# EasyEDA schematic SCH_smartFemX.json
TITLE: SmartFemX; REV: 1.0; Date: 2025-10-04; Sheet: 1/1; Drawn By: sumitmaheshwari; Company: HackAura
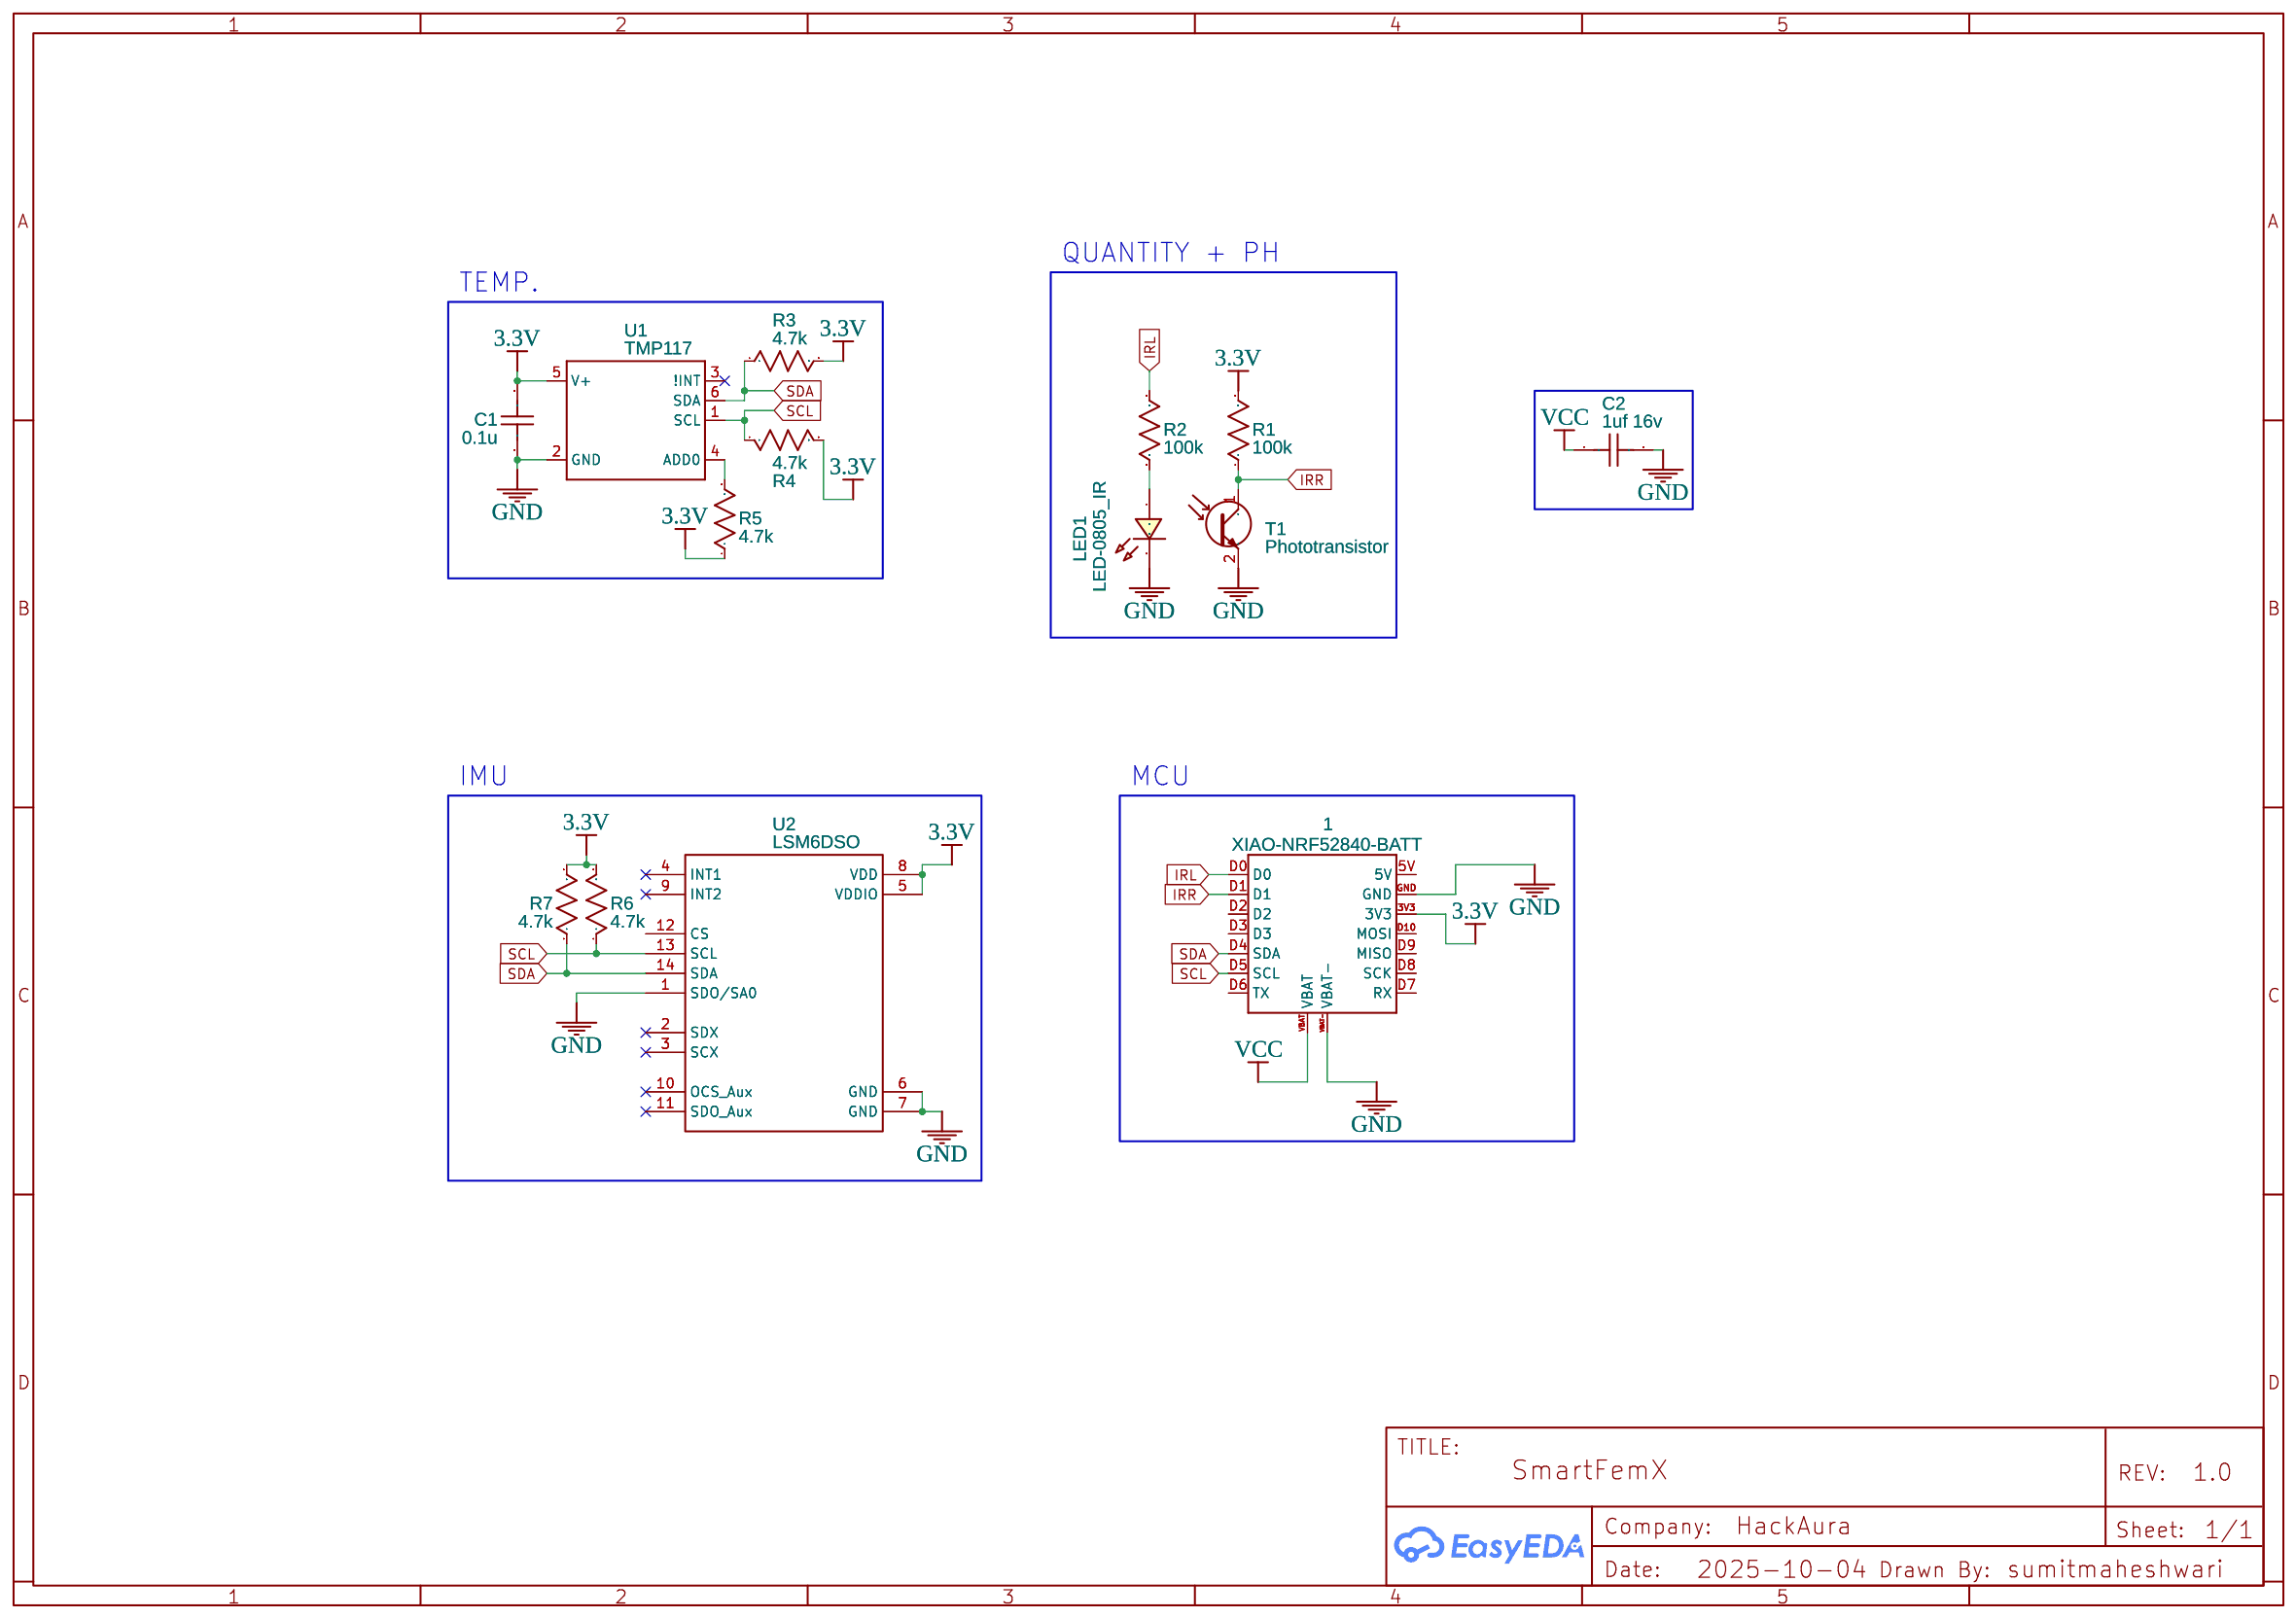
[diagram p0: schematic sheet]

## Parts
1  XIAO-NRF52840-BATT  [XIAO-NRF52840-BATT]
C1  0.1u  [C0402_NEW]
C2  1uf 16v  [SMD-2_L1.0-W0.5_D1LPC0402]
LED1  LED-0805_IR  [LED0805_RED]
R1  100k  [R0402]
R2  100k  [R0402]
R3  4.7k  [R0402]
R4  4.7k  [R0402]
R5  4.7k  [R0402]
R6  4.7k  [R0402]
R7  4.7k  [R0402]
T1  Phototransistor  [PHOTOTRANSISTOR_SMD]
U1  TMP117  [TMP117]
U2  LSM6DSO  [LGA-14L]

## Library data of the parts
1 = XIAO-NRF52840-BATT: Contributor: vimalbhalodia
C1 C2 = C_0805_US: Contributor: LCEDA_Lib
LED1 = LED-0805_R: Manufacturer: EVERLIGHT(台湾亿光); Manufacturer Part: 17-21SURC/S530-A3/TR8; Supplier Part: C72037; Contributor: LCEDA_Lib
R1-R7 = R_0805_US: Contributor: LCEDA_Lib
T1 = Phototransistor_VEMT3700-GS08_SMD: Contributor: babserg; Manufacturer Part: VEMT3700-GS08; Supplier Part: C143719; Supplier: LCSC; Manufacturer: Vishay
U1 = TMP117: Contributor: Rahul Singh
U2 = LSM6DSO: Manufacturer: ST; Supplier: Digi-Key; Supplier Part: 497-18367-6-ND; Contributor: erhans

## Nets
3.3V: 1.3V3 C1.2 R1.2 R3.2 R4.2 R5.1 R6.2 R7.2 U1.5(V+) U2.5(VDDIO) U2.8(VDD)
GND: 1.GND 1.VBAT- C1.1 C2.2 LED1.2 T1.2(E) U1.2(GND) U2.1(SDO/SA0) U2.6(GND) U2.7(GND)
VCC: 1.VBAT C2.1
IRL: 1.D0 R2.2
IRR: 1.D1 R1.1 T1.1(C)
SCL: 1.D5(SCL) R4.1 R6.1 U1.1(SCL) U2.13(SCL)
SDA: 1.D4(SDA) R3.1 R7.1 U1.6(SDA) U2.14(SDA)
Net-(LED1-1): LED1.1 R2.1
Net-(R5-2): R5.2 U1.4(ADD0)

Not connected (* = marked no-connect by the designer): 1 5V D2 D3 D6(TX) D7(RX) D8(SCK) D9(MISO) D10(MOSI); U1 3(!INT)*; U2 2(SDX)* 3(SCX)* 4(INT1)* 9(INT2)* 10(OCS_Aux)* 11(SDO_Aux)* 12(CS)

## Notes on the sheet
- QUANTITY + PH
- TEMP.
- IMU
- MCU
